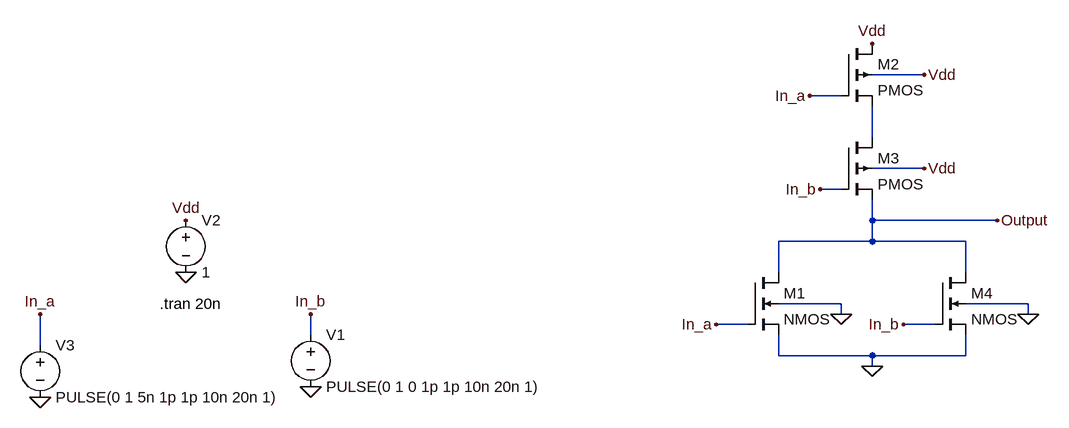
[diagram p0: schematic 1c-2.asc]
1c-2.asc, the LTspice schematic file:
Version 4
SHEET 1 1336 680
WIRE 1088 -288 1008 -288
WIRE 960 -256 912 -256
WIRE 1008 -192 1008 -240
WIRE 1088 -144 1008 -144
WIRE 960 -112 928 -112
WIRE 1008 -64 1008 -96
WIRE 1200 -64 1008 -64
WIRE 1008 -32 1008 -64
WIRE 1008 -32 864 -32
WIRE 1152 -32 1008 -32
WIRE 864 16 864 -32
WIRE 1152 16 1152 -32
WIRE 960 64 864 64
WIRE 1248 64 1152 64
WIRE 960 80 960 64
WIRE 1248 80 1248 64
WIRE 816 96 768 96
WIRE 1104 96 1056 96
WIRE 144 112 144 80
WIRE -272 128 -272 80
WIRE 864 144 864 112
WIRE 1008 144 864 144
WIRE 1152 144 1152 112
WIRE 1152 144 1008 144
WIRE 1008 160 1008 144
FLAG 144 192 0
FLAG 1200 -64 Output
FLAG 1088 -288 Vdd
FLAG 960 80 0
FLAG 768 96 In_a
FLAG -48 16 0
FLAG -48 -64 Vdd
FLAG 1056 96 In_b
FLAG 1088 -144 Vdd
FLAG 1008 160 0
FLAG 1248 80 0
FLAG 928 -112 In_b
FLAG 912 -256 In_a
FLAG -272 208 0
FLAG -272 80 In_a
FLAG 144 80 In_b
FLAG 1008 -336 Vdd
SYMBOL voltage 144 96 R0
WINDOW 123 0 0 Left 0
WINDOW 39 0 0 Left 0
SYMATTR InstName V1
SYMATTR Value PULSE(0 1 0 1p 1p 10n 20n 1)
SYMBOL pmos4 960 -336 R0
SYMATTR InstName M2
SYMBOL nmos4 816 16 R0
SYMATTR InstName M1
SYMBOL voltage -48 -80 R0
WINDOW 123 0 0 Left 0
WINDOW 39 0 0 Left 0
SYMATTR InstName V2
SYMATTR Value 1
SYMBOL pmos4 960 -192 R0
SYMATTR InstName M3
SYMBOL nmos4 1104 16 R0
SYMATTR InstName M4
SYMBOL voltage -272 112 R0
WINDOW 123 0 0 Left 0
WINDOW 39 0 0 Left 0
SYMATTR InstName V3
SYMATTR Value PULSE(0 1 5n 1p 1p 10n 20n 1)
TEXT -88 64 Left 2 !.tran 20n

The netlist it stands for:
* 1c-2.asc
V1 In_b 0 PULSE(0 1 0 1p 1p 10n 20n 1)
M2 Vdd In_a N001 Vdd PMOS
M1 Output In_a 0 0 NMOS
V2 Vdd 0 1
M3 N001 In_b Output Vdd PMOS
M4 Output In_b 0 0 NMOS
V3 In_a 0 PULSE(0 1 5n 1p 1p 10n 20n 1)
.model NMOS NMOS
.model PMOS PMOS
.lib standard.mos
.tran 20n
.backanno
.end

* Results of the author's LTspice run, read from the files saved beside the schematic
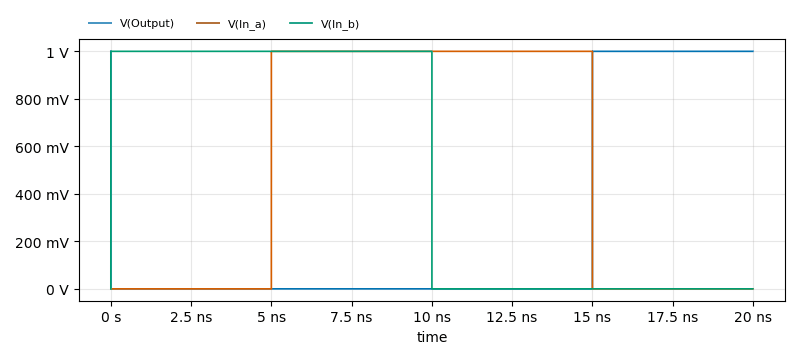
[diagram p1: Transient Analysis of 1c-2.asc, plotted from the saved traces]
* Transient Analysis, 1 run:
*   V(Output): min 0 V, max 1 V, average 249.9 mV, rms 499.9 mV, last 1 V
*   V(In_a): min 0 V, max 1 V, average 500.1 mV, rms 707.1 mV, last 0 V
*   V(In_b): min 0 V, max 1 V, average 500.1 mV, rms 707.1 mV, last 0 V